# Altium schematic sheet LPCB224 - CORE CONNECTOR.SchDoc
size A3; Address1: Factory 10; Address2: 9-13 Dingley Avenue, Dandeong, VICTORIA 3175, AUSTRALIA; DocumentNumber: 3; Revision: 1; SheetNumber: 3; SheetTotal: 7; Lockie__PCB_SUB_ASSEMBLY: Core Level Connector; Lockie__PCB_ASSEMBLY: Core Node; Lockie__LDL: LPCB224; Lockie__PCB_DESCRIPTION: Core Node
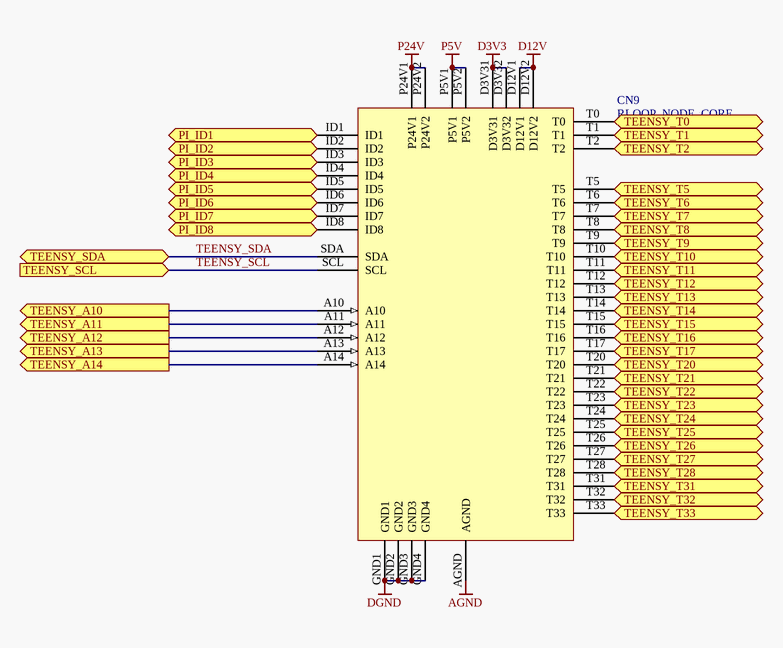
[diagram p0: LPCB224 - CORE CONNECTOR.SchDoc]

## Parts
CN9  RLOOP_NODE_CORE  [RLOOP_NODE_CORE]  (no BOM)

## Ports
PI_ID1 (out), PI_ID2 (out), PI_ID3 (out), PI_ID4 (out), PI_ID5 (out), PI_ID6 (out), PI_ID7 (out), PI_ID8 (out), TEENSY_A10 (out), TEENSY_A11 (out), TEENSY_A12 (out), TEENSY_A13 (out), TEENSY_A14 (out), TEENSY_SCL (in), TEENSY_SDA (bidir), TEENSY_T0 (bidir), TEENSY_T1 (bidir), TEENSY_T2 (bidir), TEENSY_T5 (bidir), TEENSY_T6 (bidir), TEENSY_T7 (bidir), TEENSY_T8 (bidir), TEENSY_T9 (bidir), TEENSY_T10 (bidir), TEENSY_T11 (bidir), TEENSY_T12 (bidir), TEENSY_T13 (bidir), TEENSY_T14 (bidir), TEENSY_T15 (bidir), TEENSY_T16 (bidir), TEENSY_T17 (bidir), TEENSY_T20 (bidir), TEENSY_T21 (bidir), TEENSY_T22 (bidir), TEENSY_T23 (bidir), TEENSY_T24 (bidir), TEENSY_T25 (bidir), TEENSY_T26 (bidir), TEENSY_T27 (bidir), TEENSY_T28 (bidir), TEENSY_T31 (bidir), TEENSY_T32 (bidir), TEENSY_T33 (bidir)

## Nets
AGND: CN9.AGND
D3V3: CN9.D3V31 CN9.D3V32
D12V: CN9.D12V1 CN9.D12V2
DGND: CN9.GND1 CN9.GND2 CN9.GND3 CN9.GND4
P5V: CN9.P5V1 CN9.P5V2
P24V: CN9.P24V1 CN9.P24V2
PI_ID1: CN9.ID1 ; port PI_ID1
PI_ID2: CN9.ID2 ; port PI_ID2
PI_ID3: CN9.ID3 ; port PI_ID3
PI_ID4: CN9.ID4 ; port PI_ID4
PI_ID5: CN9.ID5 ; port PI_ID5
PI_ID6: CN9.ID6 ; port PI_ID6
PI_ID7: CN9.ID7 ; port PI_ID7
PI_ID8: CN9.ID8 ; port PI_ID8
TEENSY_A10: CN9.A10 ; port TEENSY_A10
TEENSY_A11: CN9.A11 ; port TEENSY_A11
TEENSY_A12: CN9.A12 ; port TEENSY_A12
TEENSY_A13: CN9.A13 ; port TEENSY_A13
TEENSY_A14: CN9.A14 ; port TEENSY_A14
TEENSY_SCL: CN9.SCL ; port TEENSY_SCL
TEENSY_SDA: CN9.SDA ; port TEENSY_SDA
TEENSY_T0: CN9.T0 ; port TEENSY_T0
TEENSY_T1: CN9.T1 ; port TEENSY_T1
TEENSY_T2: CN9.T2 ; port TEENSY_T2
TEENSY_T5: CN9.T5 ; port TEENSY_T5
TEENSY_T6: CN9.T6 ; port TEENSY_T6
TEENSY_T7: CN9.T7 ; port TEENSY_T7
TEENSY_T8: CN9.T8 ; port TEENSY_T8
TEENSY_T9: CN9.T9 ; port TEENSY_T9
TEENSY_T10: CN9.T10 ; port TEENSY_T10
TEENSY_T11: CN9.T11 ; port TEENSY_T11
TEENSY_T12: CN9.T12 ; port TEENSY_T12
TEENSY_T13: CN9.T13 ; port TEENSY_T13
TEENSY_T14: CN9.T14 ; port TEENSY_T14
TEENSY_T15: CN9.T15 ; port TEENSY_T15
TEENSY_T16: CN9.T16 ; port TEENSY_T16
TEENSY_T17: CN9.T17 ; port TEENSY_T17
TEENSY_T20: CN9.T20 ; port TEENSY_T20
TEENSY_T21: CN9.T21 ; port TEENSY_T21
TEENSY_T22: CN9.T22 ; port TEENSY_T22
TEENSY_T23: CN9.T23 ; port TEENSY_T23
TEENSY_T24: CN9.T24 ; port TEENSY_T24
TEENSY_T25: CN9.T25 ; port TEENSY_T25
TEENSY_T26: CN9.T26 ; port TEENSY_T26
TEENSY_T27: CN9.T27 ; port TEENSY_T27
TEENSY_T28: CN9.T28 ; port TEENSY_T28
TEENSY_T31: CN9.T31 ; port TEENSY_T31
TEENSY_T32: CN9.T32 ; port TEENSY_T32
TEENSY_T33: CN9.T33 ; port TEENSY_T33

## Notes on the sheet
- PCB COMPONENT DESCRIPTION
- LDL NUMBER
- Assembly Details
- Size
- Drawing File Name
- Revision
- http://rloop.org
- Scale
- A3
- Sheet Details
- N.T.S
- Sheet:
- Of:

## Library data of the parts
CN9 = RLOOP_NODE_CORE: rLoop Node Core Connector; FMEDA__CHANNEL: COM; FMEDA__OPERATING__CURRENT_MAX: 0; FMEDA__OPERATING__TEMP_MAX: 50; FMEDA__OPERATING__TEMP_MIN: -20; FMEDA__OPERATING__TEMP_TYP: 27; FMEDA__OPERATING__VOLTAGE_MAX: 16; FMEDA__OPERATING__VOLTAGE_TYP: 12; FMEDA__OPERATING__CURRENT_MIN: 0; FMEDA__OPERATING__CURRENT_TYP: 0; FMEDA__OPERATING__VOLTAGE_MIN: 0